# Altium schematic sheet MEMORY.SchDoc
size 389 x 250 mm; SheetNumber: 4; SheetTotal: 8
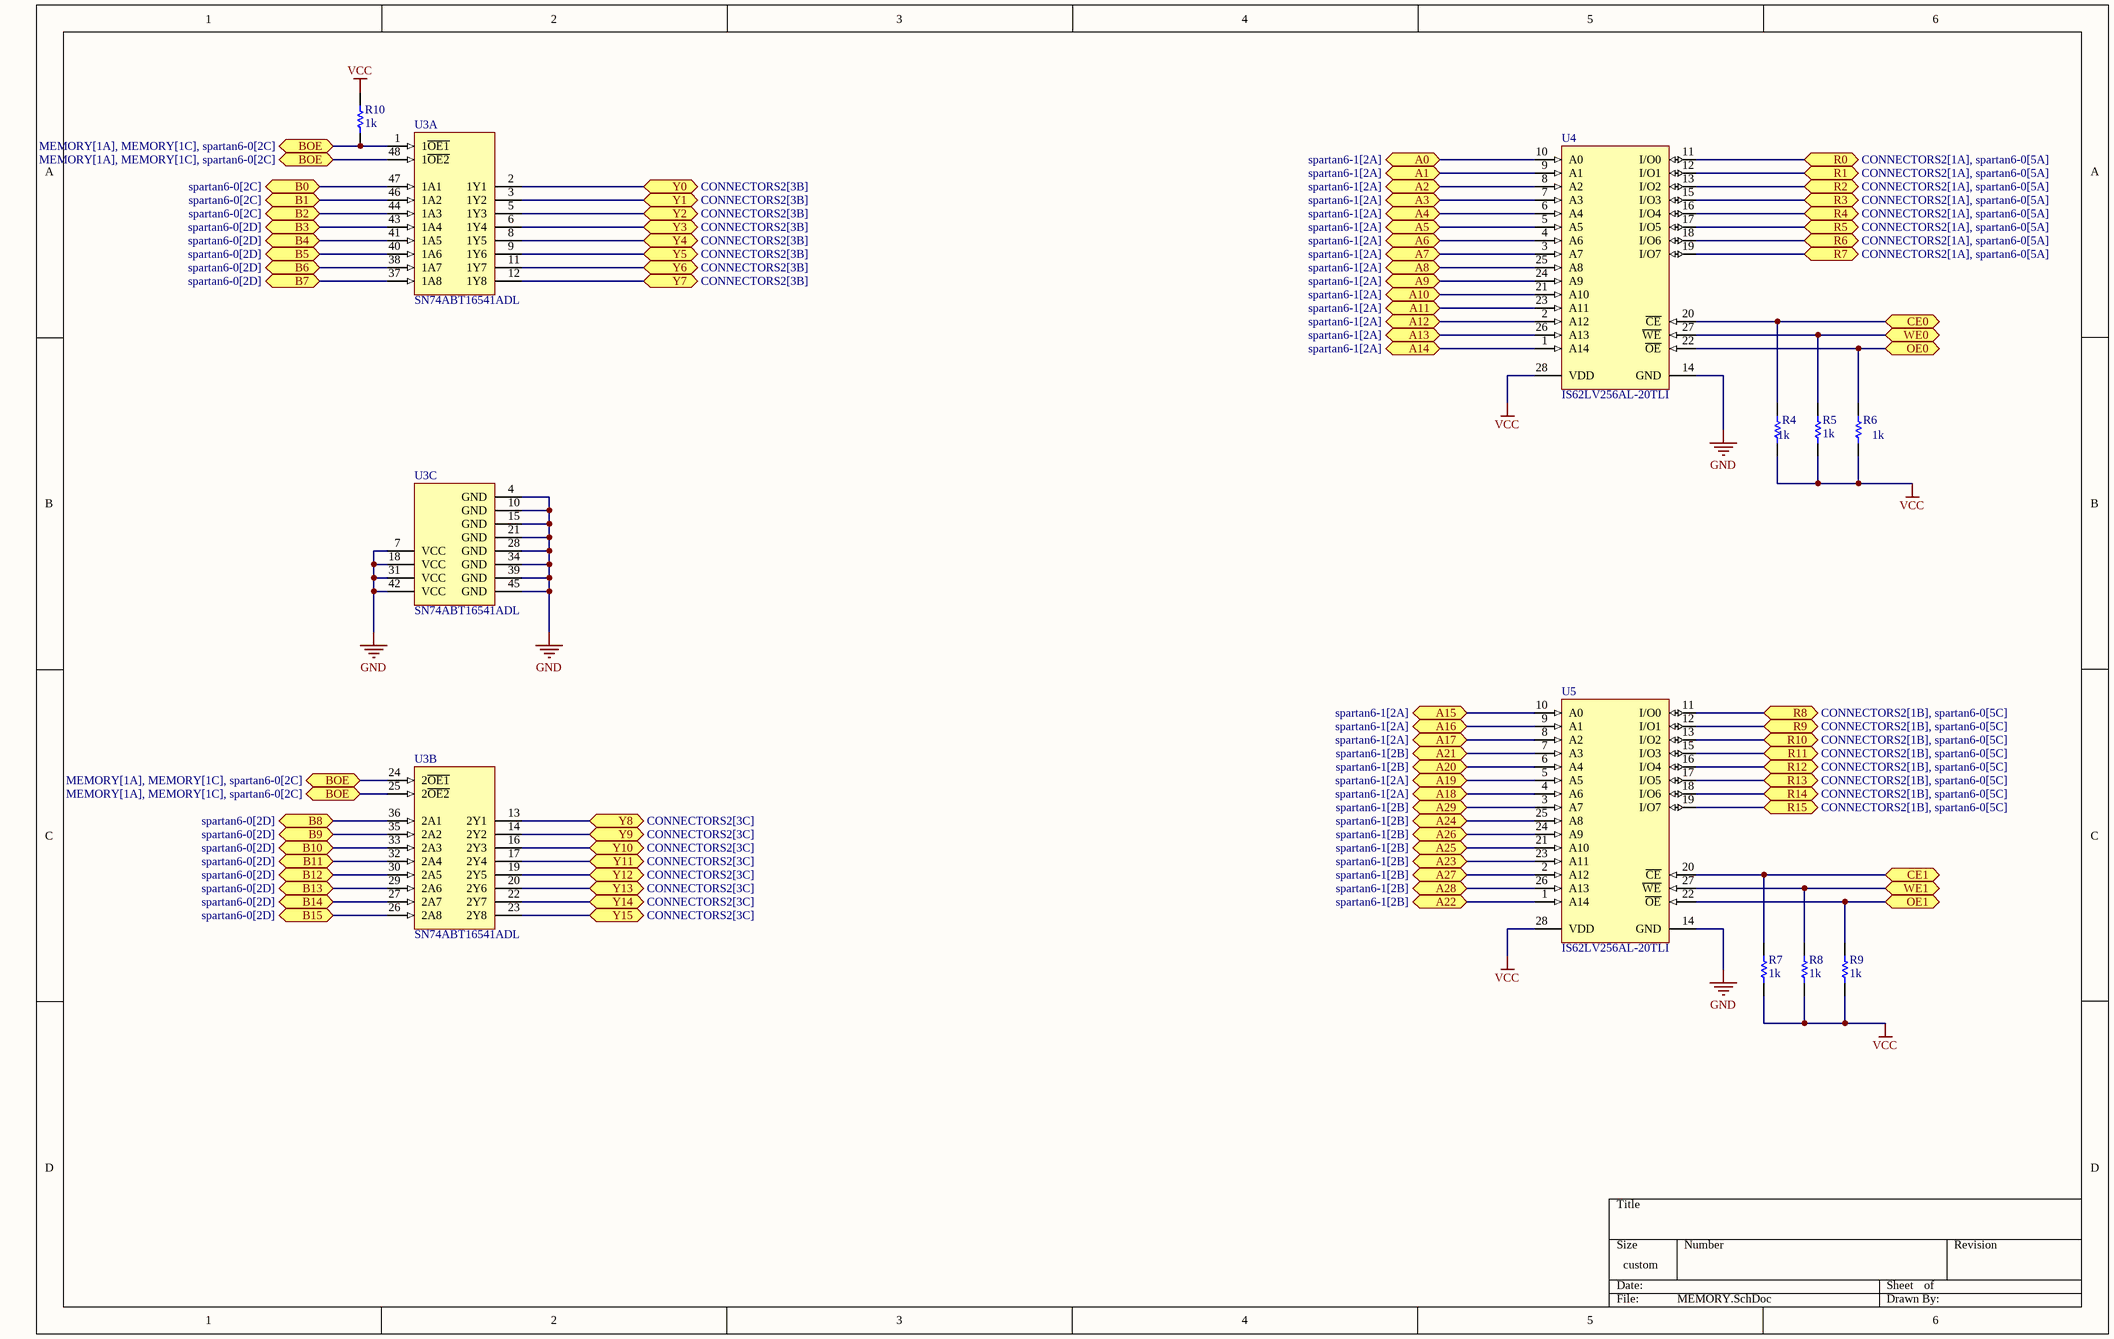
[diagram p0: MEMORY.SchDoc]

## Parts
R4  1k  [RESC2013X60X35ML10T20]
R5  1k  [RESC2013X60X35ML10T20]
R6  1k  [RESC2013X60X35ML10T20]
R7  1k  [RESC2013X60X35ML10T20]
R8  1k  [RESC2013X60X35ML10T20]
R9  1k  [RESC2013X60X35ML10T20]
R10  1k  [RESC2013X60X35ML10T20]
U3  SN74ABT16541ADL  [DL0048A_L]  (parts A,B,C of 3)
U4  IS62LV256AL-20TLI  [ISSI-TSOP-1-28-8000X13400DE_N]
U5  IS62LV256AL-20TLI  [ISSI-TSOP-1-28-8000X13400DE_N]

## Ports
A0 (bidir, see spartan6-1[2A]), A1 (bidir, see spartan6-1[2A]), A2 (bidir, see spartan6-1[2A]), A3 (bidir, see spartan6-1[2A]), A4 (bidir, see spartan6-1[2A]), A5 (bidir, see spartan6-1[2A]), A6 (bidir, see spartan6-1[2A]), A7 (bidir, see spartan6-1[2A]), A8 (bidir, see spartan6-1[2A]), A9 (bidir, see spartan6-1[2A]), A10 (bidir, see spartan6-1[2A]), A11 (bidir, see spartan6-1[2A]), A12 (bidir, see spartan6-1[2A]), A13 (bidir, see spartan6-1[2A]), A14 (bidir, see spartan6-1[2A]), A15 (bidir, see spartan6-1[2A]), A16 (bidir, see spartan6-1[2A]), A17 (bidir, see spartan6-1[2A]), A18 (bidir, see spartan6-1[2A]), A19 (bidir, see spartan6-1[2A]), A20 (bidir, see spartan6-1[2B]), A21 (bidir, see spartan6-1[2B]), A22 (bidir, see spartan6-1[2B]), A23 (bidir, see spartan6-1[2B]), A24 (bidir, see spartan6-1[2B]), A25 (bidir, see spartan6-1[2B]), A26 (bidir, see spartan6-1[2B]), A27 (bidir, see spartan6-1[2B]), A28 (bidir, see spartan6-1[2B]), A29 (bidir, see spartan6-1[2B]), B0 (bidir, see spartan6-0[2C]), B1 (bidir, see spartan6-0[2C]), B2 (bidir, see spartan6-0[2C]), B3 (bidir, see spartan6-0[2D]), B4 (bidir, see spartan6-0[2D]), B5 (bidir, see spartan6-0[2D]), B6 (bidir, see spartan6-0[2D]), B7 (bidir, see spartan6-0[2D]), B8 (bidir, see spartan6-0[2D]), B9 (bidir, see spartan6-0[2D]), B10 (bidir, see spartan6-0[2D]), B11 (bidir, see spartan6-0[2D]), B12 (bidir, see spartan6-0[2D]), B13 (bidir, see spartan6-0[2D]), B14 (bidir, see spartan6-0[2D]), B15 (bidir, see spartan6-0[2D]), BOE (bidir, see MEMORY[1A], MEMORY[1C], spartan6-0[2C]), CE0 (bidir), CE1 (bidir), OE0 (bidir), OE1 (bidir), R0 (bidir, see CONNECTORS2[1A], spartan6-0[5A]), R1 (bidir, see CONNECTORS2[1A], spartan6-0[5A]), R2 (bidir, see CONNECTORS2[1A], spartan6-0[5A]), R3 (bidir, see CONNECTORS2[1A], spartan6-0[5A]), R4 (bidir, see CONNECTORS2[1A], spartan6-0[5A]), R5 (bidir, see CONNECTORS2[1A], spartan6-0[5A]), R6 (bidir, see CONNECTORS2[1A], spartan6-0[5A]), R7 (bidir, see CONNECTORS2[1A], spartan6-0[5A]), R8 (bidir, see CONNECTORS2[1B], spartan6-0[5C]), R9 (bidir, see CONNECTORS2[1B], spartan6-0[5C]), R10 (bidir, see CONNECTORS2[1B], spartan6-0[5C]), R11 (bidir, see CONNECTORS2[1B], spartan6-0[5C]), R12 (bidir, see CONNECTORS2[1B], spartan6-0[5C]), R13 (bidir, see CONNECTORS2[1B], spartan6-0[5C]), R14 (bidir, see CONNECTORS2[1B], spartan6-0[5C]), R15 (bidir, see CONNECTORS2[1B], spartan6-0[5C]), WE0 (bidir), WE1 (bidir), Y0 (bidir, see CONNECTORS2[3B]), Y1 (bidir, see CONNECTORS2[3B]), Y2 (bidir, see CONNECTORS2[3B]), Y3 (bidir, see CONNECTORS2[3B]), Y4 (bidir, see CONNECTORS2[3B]), Y5 (bidir, see CONNECTORS2[3B]), Y6 (bidir, see CONNECTORS2[3B]), Y7 (bidir, see CONNECTORS2[3B]), Y8 (bidir, see CONNECTORS2[3C]), Y9 (bidir, see CONNECTORS2[3C]), Y10 (bidir, see CONNECTORS2[3C]), Y11 (bidir, see CONNECTORS2[3C]), Y12 (bidir, see CONNECTORS2[3C]), Y13 (bidir, see CONNECTORS2[3C]), Y14 (bidir, see CONNECTORS2[3C]), Y15 (bidir, see CONNECTORS2[3C])

## Nets
GND: U3.4(GND) U3.7(VCC) U3.10(GND) U3.15(GND) U3.18(VCC) U3.21(GND) U3.28(GND) U3.31(VCC) U3.34(GND) U3.39(GND) U3.42(VCC) U3.45(GND) U4.14(GND) U5.14(GND)
VCC: R4.2 R5.2 R6.2 R7.2 R8.2 R9.2 R10.1 U4.28(VDD) U5.28(VDD)
A0: U4.10(A0) ; port A0
A1: U4.9(A1) ; port A1
A2: U4.8(A2) ; port A2
A3: U4.7(A3) ; port A3
A4: U4.6(A4) ; port A4
A5: U4.5(A5) ; port A5
A6: U4.4(A6) ; port A6
A7: U4.3(A7) ; port A7
A8: U4.25(A8) ; port A8
A9: U4.24(A9) ; port A9
A10: U4.21(A10) ; port A10
A11: U4.23(A11) ; port A11
A12: U4.2(A12) ; port A12
A13: U4.26(A13) ; port A13
A14: U4.1(A14) ; port A14
A15: U5.10(A0) ; port A15
A16: U5.9(A1) ; port A16
A17: U5.8(A2) ; port A17
A18: U5.4(A6) ; port A18
A19: U5.5(A5) ; port A19
A20: U5.6(A4) ; port A20
A21: U5.7(A3) ; port A21
A22: U5.1(A14) ; port A22
A23: U5.23(A11) ; port A23
A24: U5.25(A8) ; port A24
A25: U5.21(A10) ; port A25
A26: U5.24(A9) ; port A26
A27: U5.2(A12) ; port A27
A28: U5.26(A13) ; port A28
A29: U5.3(A7) ; port A29
B0: U3.47(1A1) ; port B0
B1: U3.46(1A2) ; port B1
B2: U3.44(1A3) ; port B2
B3: U3.43(1A4) ; port B3
B4: U3.41(1A5) ; port B4
B5: U3.40(1A6) ; port B5
B6: U3.38(1A7) ; port B6
B7: U3.37(1A8) ; port B7
B8: U3.36(2A1) ; port B8
B9: U3.35(2A2) ; port B9
B10: U3.33(2A3) ; port B10
B11: U3.32(2A4) ; port B11
B12: U3.30(2A5) ; port B12
B13: U3.29(2A6) ; port B13
B14: U3.27(2A7) ; port B14
B15: U3.26(2A8) ; port B15
BOE: R10.2 U3.1(1~{OE1}) U3.24(2~{OE1}) U3.25(2~{OE2}) U3.48(1~{OE2}) ; port BOE
CE0: R4.1 U4.20(~{CE}) ; port CE0
CE1: R7.1 U5.20(~{CE}) ; port CE1
OE0: R6.1 U4.22(~{OE}) ; port OE0
OE1: R9.1 U5.22(~{OE}) ; port OE1
R0: U4.11(I/O0) ; port R0
R1: U4.12(I/O1) ; port R1
R2: U4.13(I/O2) ; port R2
R3: U4.15(I/O3) ; port R3
R4: U4.16(I/O4) ; port R4
R5: U4.17(I/O5) ; port R5
R6: U4.18(I/O6) ; port R6
R7: U4.19(I/O7) ; port R7
R8: U5.11(I/O0) ; port R8
R9: U5.12(I/O1) ; port R9
R10: U5.13(I/O2) ; port R10
R11: U5.15(I/O3) ; port R11
R12: U5.16(I/O4) ; port R12
R13: U5.17(I/O5) ; port R13
R14: U5.18(I/O6) ; port R14
R15: U5.19(I/O7) ; port R15
WE0: R5.1 U4.27(~{WE}) ; port WE0
WE1: R8.1 U5.27(~{WE}) ; port WE1
Y0: U3.2(1Y1) ; port Y0
Y1: U3.3(1Y2) ; port Y1
Y2: U3.5(1Y3) ; port Y2
Y3: U3.6(1Y4) ; port Y3
Y4: U3.8(1Y5) ; port Y4
Y5: U3.9(1Y6) ; port Y5
Y6: U3.11(1Y7) ; port Y6
Y7: U3.12(1Y8) ; port Y7
Y8: U3.13(2Y1) ; port Y8
Y9: U3.14(2Y2) ; port Y9
Y10: U3.16(2Y3) ; port Y10
Y11: U3.17(2Y4) ; port Y11
Y12: U3.19(2Y5) ; port Y12
Y13: U3.20(2Y6) ; port Y13
Y14: U3.22(2Y7) ; port Y14
Y15: U3.23(2Y8) ; port Y15

## Library data of the parts
R4-R10 = CMP-2100-03673-1: Chip Resistor, 0 Ohm, Jumper, +/- 5%, 0.125 W, -55 to 155 degC, 0805 (2012 Metric), RoHS, Tape and Reel; Manufacturer: Yageo; Power Rating: 125mW; Resistance: 0mOhm; Voltage Rating (DC): 150V; Temperature Coefficient: 200ppm/degreesC; Height: 0.5mm; Depth: 1.25mm; Case Code (Imperial): 0805; Lead Free: LeadFree; Military Standard: Not; Package Description: 2-Pin Surface Mounted Device, Body 2 x 1.25 mm; Case Code (Metric): 2012; Composition: ThickFilm; Voltage Rating: 150V; Manufacturer URL: http://www.yageo.com/; Packaging: TapeandReel; Package Reference: 0805; REACH SVHC: Unknown; Tolerance: 5%; Case/Package: 0805; Max Operating Temperature: 155degC; Number of Pins: 2; Min Operating Temperature: -55degC; RoHSCompliant: true; Length: 2mm; Datasheet URL: http://www.yageo.com/NewPortal/yageodocoutput?fileName=/pdf/R-Chip/PYu-RC_Group_51_RoHS_L_5.pdf; Termination: SMD/SMT; Radiation Hardening: No; Width: 1.25mm; Contact Plating: Tin; Datasheet Version: Rev. 5, 10/2016
U3 = CMP-0440-00612-3: 16-Bit Buffers/Drivers With 3-State Outputs, DL0048A, TUBE; Manufacturer: Texas Instruments; VCC(Min)(V): 4.5; VCC(Max)(V): 5.5; Input Type: TTL; F @ Nom Voltage(Max)(Mhz): 150; Rating: Catalog; ICC @ Nom Voltage(Max)(mA): 0.034; Bits(#): 16; Voltage(Nom)(V): 5; tpd @ Nom Voltage(Max)(ns): 4.2; PackageVersion: http://www.ti.com/lit/ml/mpds490/mpds490.pdf; PackageReference: DL0048A; Code_JEDEC: MO-118; Operating Temperature Range(C): -40 to 85; Generic Part Number: SN74ABT16541A; DatasheetVersion: SCBS118C; Output Type: TTL
U4 U5 = CMP-0515-00096-2: 256 K Low Voltage CMOS SRAM, 32 K x 8, -40 to 85 degC, 28-Pin SOP (TSOP-1-28), Pb-Free; Manufacturer: Integrated Silicon Solution Inc (ISSI); Density: 256K; Organization: 32K x 8; Speed (ns): 20; Packing: Tray / Tube; RoHS: Pb-Free; ComponentLink2Description: Datasheet; Mounting Technology: Surface Mount; ComponentLink2URL: http://www.issi.com/WW/pdf/62-65LV256AL.pdf; ComponentLink3URL: http://www.issi.com/WW/pdf/62-65C256AL.pdf; ComponentLink1URL: http://www.issi.com/US/index.shtml; ComponentLink1Description: Manufacturer URL; ComponentLink3Description: Package Specification; PackageVersion: Rev. F, 09/2009; PackageReference: TSOP-1-28; Code_JEDEC: MO- 183; PartNumber: IS62LV256AL-20TLI; PackageDescription: 28-Pin 8 x 13.4 mm TSOP-1, Pitch 0.55 mm; DatasheetVersion: Rev. C